# EAGLE design seletor (EAGLE 7.6.0)
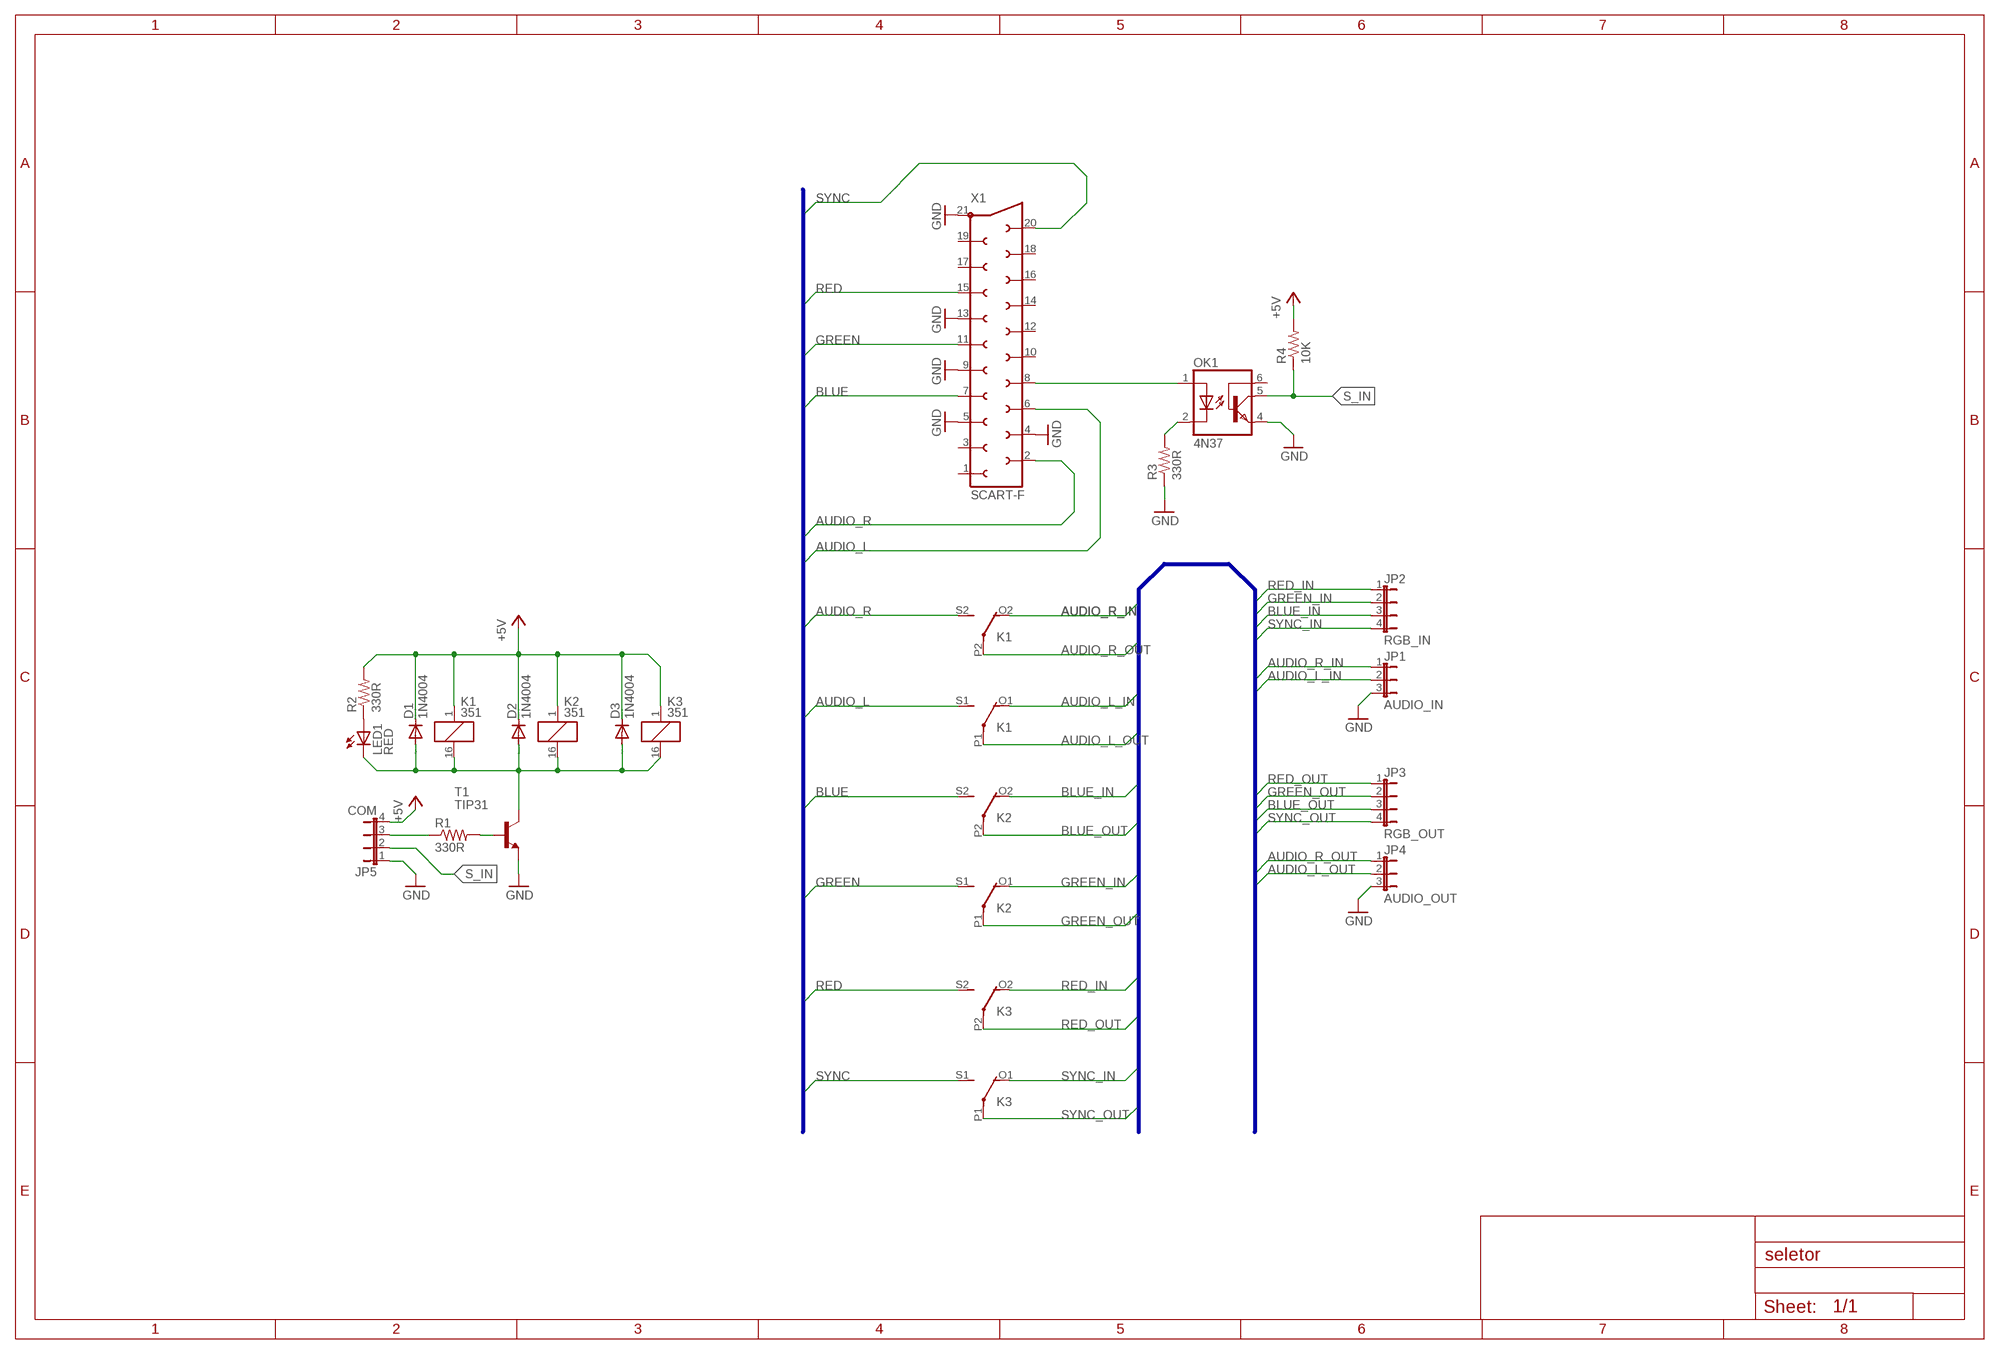
[diagram p0: schematic, sheet 1]

## Parts
D1  1N4004  [DO41-10]
D2  1N4004  [DO41-10]
D3  1N4004  [DO41-10]
JP1  AUDIO_IN  JP2E  [JP2]
JP2  RGB_IN  JP4E  [JP4]
JP3  RGB_OUT  JP4E  [JP4]
JP4  AUDIO_OUT  JP2E  [JP2]
JP5  COM  JP4E  [JP4]
K1  351  [351]
K2  351  [351]
K3  351  [351]
LED1  RED  LED5MM  [LED5MM]
OK1  4N37  [DIL06]
R1  330R  R-US_0204/7  [0204/7]
R2  330R  R-US_0204/2V  [0204V]
R3  330R  R-US_0204/2V  [0204V]
R4  10K  R-US_0204/2V  [0204V]
T1  TIP31  [TO220]
X1  SCART-F  [SCART-F]

## Nets
+5V: D1.C D2.C D3.C JP5.4 K1.1 K2.1 K3.1 R2.2 R4.2
AUDIO_L [singal]: K1.S1(2:S) X1.6
AUDIO_L_IN [singal]: JP1.2 K1.O1(2:O)
AUDIO_L_OUT [singal]: JP4.2 K1.P1(2:P)
AUDIO_R [singal]: K1.S2(3:S) X1.2
AUDIO_R_IN [singal]: JP1.1 K1.O2(3:O)
AUDIO_R_OUT [singal]: JP4.1 K1.P2(3:P)
BLUE [singal]: K2.S2(3:S) X1.7
BLUE_IN [singal]: JP2.3 K2.O2(3:O)
BLUE_OUT [singal]: JP3.3 K2.P2(3:P)
GND: JP1.3 JP4.3 JP5.1 OK1.4(EMI) R3.1 T1.3(E) X1.4 X1.5 X1.9 X1.13 X1.21
GREEN [singal]: K2.S1(2:S) X1.11
GREEN_IN [singal]: JP2.2 K2.O1(2:O)
GREEN_OUT [singal]: JP3.2 K2.P1(2:P)
N$1: JP5.3 R1.1
N$2: D1.A D2.A D3.A K1.16 K2.16 K3.16 LED1.K(C) T1.2(C)
N$3: LED1.A R2.1
N$4: OK1.1(A) X1.8
N$5: OK1.2(C) R3.2
N$7: R1.2 T1.1(B)
RED [singal]: K3.S2(3:S) X1.15
RED_IN [singal]: JP2.1 K3.O2(3:O)
RED_OUT [singal]: JP3.1 K3.P2(3:P)
S_IN: JP5.2 OK1.5(COL) R4.1
SYNC [singal]: K3.S1(2:S) X1.20
SYNC_IN [singal]: JP2.4 K3.O1(2:O)
SYNC_OUT [singal]: JP3.4 K3.P1(2:P)
Unconnected: OK1.6(BAS) X1.1 X1.3 X1.10 X1.12 X1.14 X1.16 X1.17 X1.18 X1.19

## Buses
B$1
B$2

## Library data of the parts
D1-D3 = diode:1N4004: DIODE general purpose rectifier, 1 A
JP1 JP4 = jumper:JP2E: JUMPER
JP2 JP3 JP5 = jumper:JP4E: JUMPER
K1-K3 = relay:351: RELAY 2 x switch, Omron; OC_FARNELL: unknown; OC_NEWARK: unknown
LED1 = led:LED: LED OSRAM: - CHIPLED LG R971, LG N971, LY N971, LG Q971, LY Q971, LO R971, LY R971 LH N974, LH R974 LS Q976, LO Q976, LY Q976 LO Q996 - Hyper CHIPLED LW Q18S LB Q993, LB Q99A, LB R99A - SideLED LS A670, LO A670, LY A670, LG A670, LP A670 LB A673, LV A673, LT A673, LW A673 LH A674 LY A675 LS A676, LA A676, LO A676, LY A676, LW A676 LS A679, LY A679, LG A679 - Hyper Micro SIDELED® LS Y876, LA Y876, LO Y876, LY Y876 LT Y87S - SmartLED LW L88C, LW L88S LB L89C, LB L89S, LG L890 LS L89K, LO L89K, LY L89K LS L896, LA L896, LO L896, LY L896 - TOPLED LS T670, LO T670, LY T670, LG T670, LP T670 LSG T670, LSP T670, LSY T670, LOP T670, LYG T670 LG T671, LOG T671, LSG T671 LB T673, LV T673, LT T673, LW T673 LH T674 LS T676, LA T676, LO T676, LY T676, LB T676, LH T676, LSB T676, LW T676 LB T67C, LV T67C, LT T67C, LS T67K, LO T67K, LY T67K, LW E67C LS E67B, LA E67B, LO E67B, LY E67B, LB E67C, LV E67C, LT E67C LW T67C LS T679, LY T679, LG T679 LS T770, LO T770, LY T770, LG T770, LP T770 LB T773, LV T773, LT T773, LW T773 LH T774 LS E675, LA E675, LY E675, LS T675 LS T776, LA T776, LO T776, LY T776, LB T776 LHGB T686 LT T68C, LB T68C - Hyper Mini TOPLED® LB M676 - Mini TOPLED Santana® LG M470 LS M47K, LO M47K, LY M47K Source: http://www.osram.convergy.de LUXEON: - LUMILED® LXK2-PW12-R00, LXK2-PW12-S00, LXK2-PW14-U00, LXK2-PW14-V00 LXK2-PM12-R00, LXK2-PM12-S00, LXK2-PM14-U00 LXK2-PE12-Q00, LXK2-PE12-R00, LXK2-PE12-S00, LXK2-PE14-T00, LXK2-PE14-U00 LXK2-PB12-K00, LXK2-PB12-L00, LXK2-PB12-M00, LXK2-PB14-N00, LXK2-PB14-P00, LXK2-PB14-Q00 LXK2-PR12-L00, LXK2-PR12-M00, LXK2-PR14-Q00, LXK2-PR14-R00 LXK2-PD12-Q00, LXK2-PD12-R00, LXK2-PD12-S00 LXK2-PH12-R00, LXK2-PH12-S00 LXK2-PL12-P00, LXK2-PL12-Q00, LXK2-PL12-R00 Source: www.luxeon.com KINGBRIGHT: KA-3528ASYC Source: www.kingbright.com
OK1 = optocoupler:4N37: OPTO COUPLER Source: http://www.fairchildsemi.com/pf/4N/4N35-M.html; MF: FAIRCHILD SEMICONDUCTOR; MPN: 4N37; OC_FARNELL: 1612456; OC_NEWARK: 72K9948
R1-R4 = rcl:R-US_: RESISTOR, American symbol
T1 = transistor:TIP31: NPN Transistor Medium Power Linear Switching Applications Source: http://onsemi.com
X1 = con-hirschmann:SCART-F: TV SCART CONNECTOR; OC_FARNELL: unknown; OC_NEWARK: unknown

## Net classes
0 default: width 0.406 mm
1 singal: width 0.5 mm

## Board
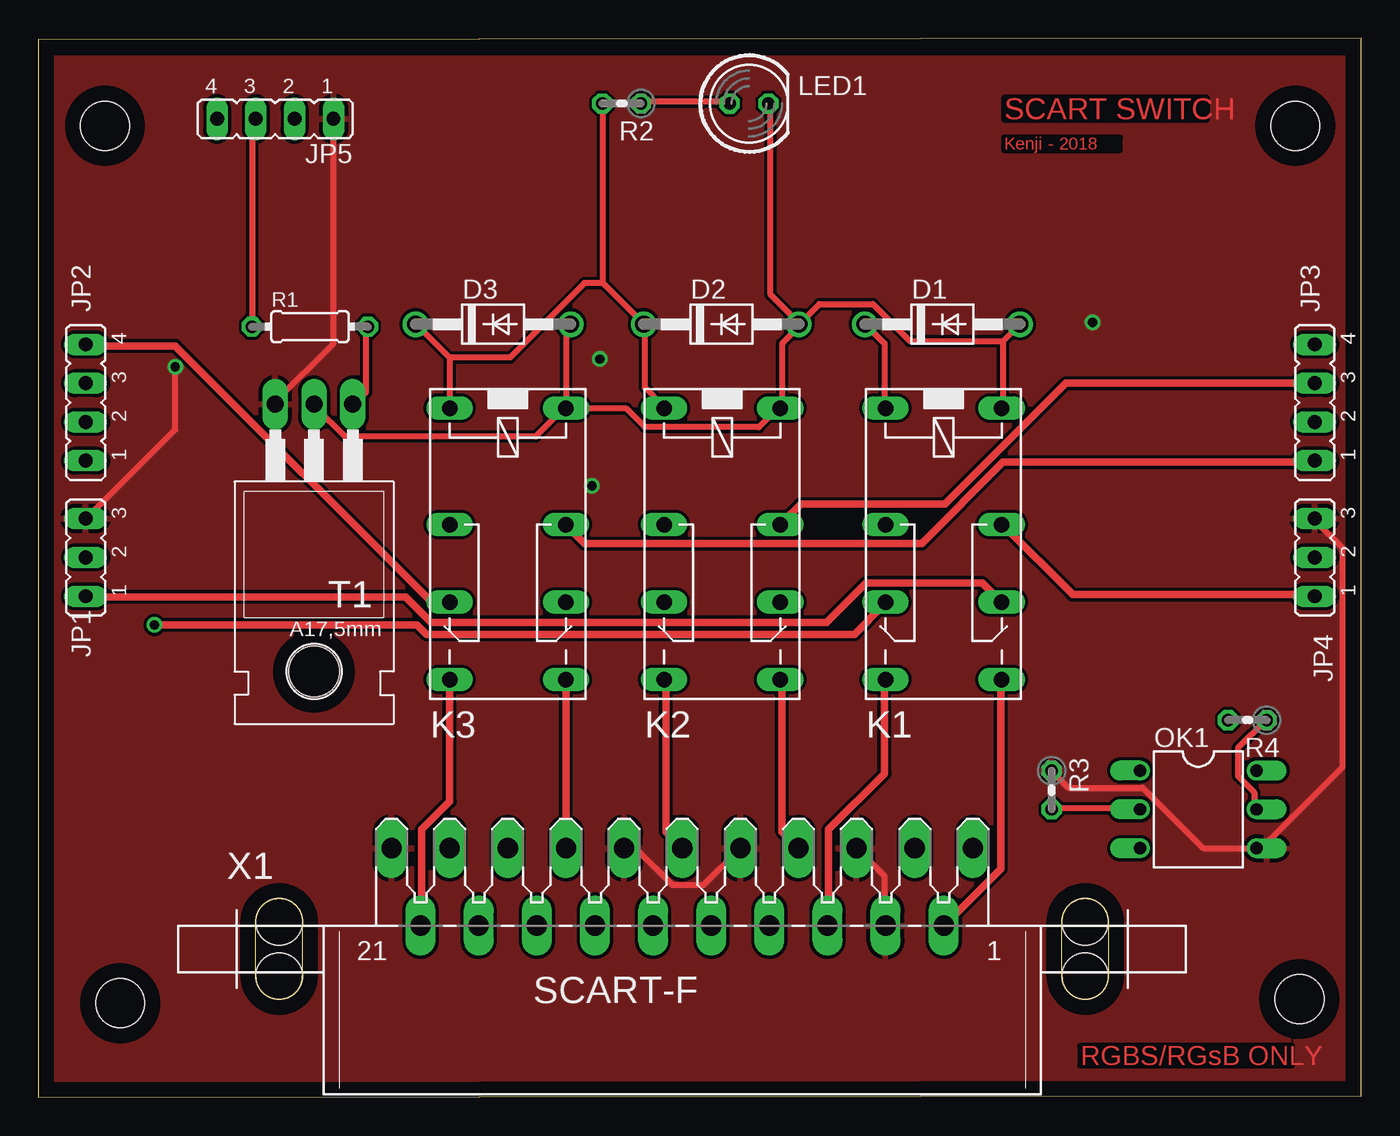
[diagram p1: board, top side]
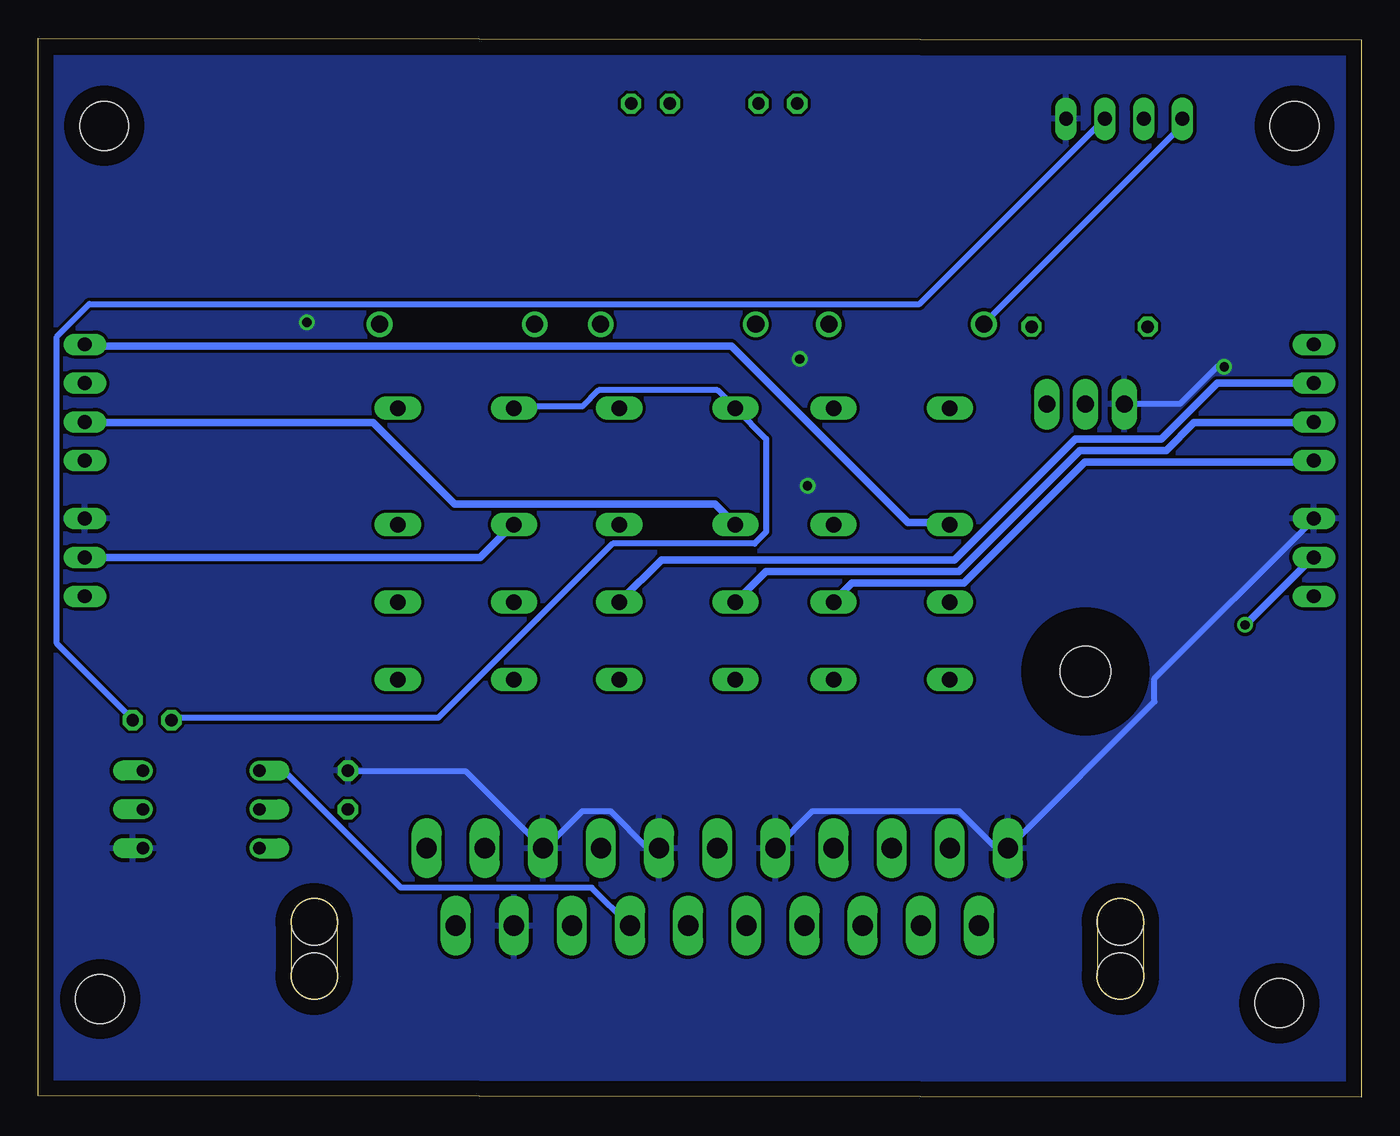
[diagram p2: board, bottom side, seen from below]

Size 86.72 x 69.43 mm. Coordinates in mm from the lower left corner, seen from the top.
Outline: 0,0 86.72,0.1 86.72,69.43 0,69.33 0,0
Copper layers (1*16): Top 0.035mm / dielectric 1.5mm / Bottom 0.035mm
Design rules "default": minimum track width 10mil, minimum drill 24mil, track to track 8mil, track to pad 8mil, pad to pad 8mil, via to via 8mil, smd to smd 8mil, copper to edge 40mil, drill to drill 8mil, minimum pad ring 10mil, minimum via ring 8mil, stop-mask expansion 4mil, vias tented up to drill 0mil, thermal gap 10mil
Holes 3.2 mm at 5.38,6.18 82.66,6.45 4.38,63.68 82.39,63.68

### Footprints (pad centres in the part's own frame; a part is rotated, then mirrored left to right if it is on the bottom)
DO41-10 = drill 1.118: A 5.08,0; C -5.08,0
JP2 = drill 0.914 long: 1 -2.54,0; 2 0,0; 3 2.54,0
JP4 = drill 0.914 long: 1 -3.81,0; 2 -1.27,0; 3 1.27,0; 4 3.81,0
351 = drill 1.016 long: 1 -3.81,-3.81; 16 -3.81,3.81; O1 8.89,-3.81; O2 8.89,3.81; P1 3.81,-3.81; P2 3.81,3.81; S1 13.97,-3.81; S2 13.97,3.81
LED5MM = drill 0.813 octagon: A -1.27,0; K 1.27,0
DIL06 = drill 0.813 offset: 1 -2.54,-3.81; 2 0,-3.81; 3 2.54,-3.81; 4 2.54,3.81; 5 0,3.81; 6 -2.54,3.81
0204/7 = drill 0.813 octagon: 1 -3.81,0; 2 3.81,0
0204V = drill 0.813 octagon: 1 -1.27,0; 2 1.27,0
TO220 = drill 1.118 long: 1 -2.54,-6.35; 2 0,-6.35; 3 2.54,-6.35 | hole 3.302: 0,11.176
SCART-F = drill 1.321 long: 1 19.05,5.08; 2 17.145,0; 3 15.24,5.08; 4 13.335,0; 5 11.43,5.08; 6 9.525,0; 7 7.62,5.08; 8 5.715,0; 9 3.81,5.08; 10 1.905,0; 11 0,5.08; 12 -1.905,0; 13 -3.81,5.08; 14 -5.715,0; 15 -7.62,5.08; 16 -9.525,0; 17 -11.43,5.08; 18 -13.335,0; 19 -15.24,5.08; 20 -17.145,0; 21 -19.05,5.08 | hole 3.023: 26.416,0.254; 26.416,-3.302; -26.416,0.254; -26.416,-3.302

### Placement (x,y rotation side)
D1  59.26,50.68 0 top
D2  44.77,50.68 0 top
D3  29.82,50.68 0 top
JP1  3.11,35.39 90 top
JP2  3.11,45.55 90 top
JP3  83.66,45.55 90 top
JP4  83.66,35.39 90 top
JP5  15.54,64.14 180 top
K1  59.34,41.36 270 top
K2  44.83,41.36 270 top
K3  30.78,41.36 270 top
LED1  46.59,65.14 0 top
OK1  76.04,18.88 270 top
R1  17.81,50.52 0 top
R2  38.24,65.14 180 top
R3  66.42,20.15 270 top
R4  79.25,24.73 180 top
T1  18.08,39.09 180 top
X1  42.21,11.26 0 top

### Tracks (layer width: path | path; a pad name or v marks a point on that pad's centre or on a via)
+5V
  Top 0.406: 26.97,48.5 K3.1 | 26.97,48.5 24.84,50.63 D3.C | 37.03,53.37 37.03,65.11 R2.2 | 37.03,53.37 39.62,50.78 D2.C 39.77,50.63 39.77,46.52 40.99,45.3 K2.1 | K1.1 55.47,45.3 55.47,49.41 54.25,50.63 D1.C | 26.97,48.5 30.93,48.5 35.81,53.37 37.03,53.37
  Bottom 0.406: JP5.4 11.73,63.74 24.68,50.78 D3.C | R4.2 77.87,24.87 60.5,24.87 49.07,36.3 39.77,36.3 39.01,37.07 39.01,43.16 40.99,45.14 K2.1 41.14,45.3 42.21,46.36 49.98,46.36 51.05,45.3 55.47,45.3 K1.1
AUDIO_L
  Top 0.5: K1.S1 55.47,27.31 55.47,21.22 51.81,17.56 51.81,11.31 X1.6
AUDIO_L_IN  (via drill 0.61)
  Top 0.5: v7.62,30.97 24.84,30.97 25.45,30.36 53.49,30.36 55.47,32.34 K1.O1
  Bottom 0.5: v7.62,30.97 3.2,35.39 JP1.2
AUDIO_L_OUT
  Bottom 0.5: JP4.2 57.75,35.39 55.62,37.52 K1.P1
AUDIO_R
  Top 0.5: K1.S2 63.09,27.31 63.09,14.97 59.43,11.31 X1.2
AUDIO_R_IN
  Top 0.5: JP1.1 3.2,32.8 24.07,32.8 25.75,31.12 51.66,31.12 54.25,33.71 61.87,33.71 63.09,32.49 K1.O2
AUDIO_R_OUT
  Top 0.5: JP4.1 83.51,32.95 67.81,32.95 63.24,37.52 K1.P2
BLUE
  Top 0.5: X1.7 48.76,17.41 48.76,27.31 K2.S2
BLUE_IN
  Bottom 0.5: JP2.3 9.44,46.82 13.1,43.16 18.74,43.16 26.66,35.24 45.87,35.24 48.61,32.49 K2.O2
BLUE_OUT
  Top 0.5: JP3.3 67.36,46.82 59.43,38.9 49.98,38.9 48.76,37.68 K2.P2
GND  (via drill 0.61)
  Top 0.406: JP5.1 19.35,49.41 15.54,45.6 T1.3 | v8.99,47.89 8.99,43.77 3.2,37.98 JP1.3 | X1.13 39.16,16.34 41.6,13.9 43.58,13.9 X1.9 | R3.1 66.44,21.37 67.51,20.3 72.38,20.3 76.35,16.34 OK1.4 80.16,16.34 85.49,21.67 85.49,36 83.66,37.83 JP4.3 | X1.5 55.47,14.51 55.47,11.31 X1.4
  Bottom 0.406: JP1.3 3.2,37.83 13.56,27.46 13.56,25.94 X1.21 23.92,16.34 26.36,18.78 35.96,18.78 X1.13 | v8.99,47.89 9.44,47.89 11.88,45.45 T1.3 | R3.1 66.29,21.37 58.67,21.37 X1.5 53.49,16.34 51.05,18.78 49.22,18.78 46.78,16.34 X1.9
  other vias: 36.3,40.1 69.1,50.8 36.8,48.4
  pour Bottom: 0.5,68.1 86.3,68.1 86.3,1.1 0.5,1.1
  pour Top: 0.5,68.1 86.3,68.1 86.3,1.1 0.5,1.1
GREEN
  Top 0.5: X1.11 41.14,17.41 41.14,27.31 K2.S1
GREEN_IN
  Bottom 0.5: JP2.2 3.2,44.23 10.97,44.23 12.8,42.4 18.44,42.4 26.36,34.48 39.01,34.48 40.99,32.49 K2.O1
GREEN_OUT
  Bottom 0.5: JP3.2 83.51,44.23 64.77,44.23 59.43,38.9 42.36,38.9 41.14,37.68 K2.P1
N$1
  Top 0.406: R1.1 14.02,50.63 14.02,63.89 14.17,64.04 JP5.3
N$2
  Top 0.406: K3.16 34.59,50.33 34.89,50.63 D3.A | T1.2 18.13,45.3 20.11,43.32 32.61,43.32 34.44,45.14 K3.16 | 63.24,49.56 63.24,45.3 K1.16 | 63.24,49.56 64.31,50.63 D1.A | LED1.K 48,65.11 48,52.61 49.83,50.78 D2.A | D2.A 49.83,50.48 48.76,49.41 48.76,45.3 K2.16 48.46,45.14 47.24,43.92 39.77,43.92 38.55,45.14 34.74,45.14 K3.16 | 63.24,49.56 57.14,49.56 54.71,52 51.2,52 49.98,50.78 D2.A
N$3
  Top 0.406: R2.1 39.62,65.26 45.26,65.26 LED1.A
N$4
  Bottom 0.406: OK1.1 72.08,21.37 70.56,21.37 62.94,13.75 50.44,13.75 48,11.31 X1.8
N$5
  Top 0.406: R3.2 66.44,18.93 72.08,18.93 OK1.2
N$7
  Top 0.406: R1.2 21.48,50.48 21.48,46.21 20.72,45.45 T1.1
RED
  Top 0.5: X1.15 K3.S2
RED_IN
  Bottom 0.5: JP2.1 3.2,41.64 18.13,41.64 26.06,33.71 33.37,33.71 34.59,32.49 K3.O2
RED_OUT
  Top 0.5: JP3.1 83.51,41.64 63.24,41.64 57.91,36.3 35.81,36.3 34.59,37.52 K3.P2
S_IN
  Top 0.406: OK1.5 79.7,18.93 79.7,20 78.63,21.06 78.63,22.89 80.46,24.72 R4.1
  Bottom 0.406: JP5.2 16.91,64.04 28.95,52 83.36,52 85.49,49.87 85.49,29.75 80.61,24.87 R4.1
SYNC
  Top 0.5: K3.S1 26.97,19.39 25.14,17.56 25.14,11.31 X1.20
SYNC_IN
  Top 0.5: JP2.4 3.2,49.26 8.99,49.26 25.75,32.49 26.97,32.49 K3.O1
SYNC_OUT
  Bottom 0.5: JP3.4 83.51,49.26 41.3,49.26 29.71,37.68 26.97,37.68 K3.P1

### Text on the board
Top: SCART SWITCH | Kenji - 2018 | RGBS/RGsB ONLY